# Altium schematic sheet FPGA_Power&GND.SchDoc: FPGA Power&GND
size A4
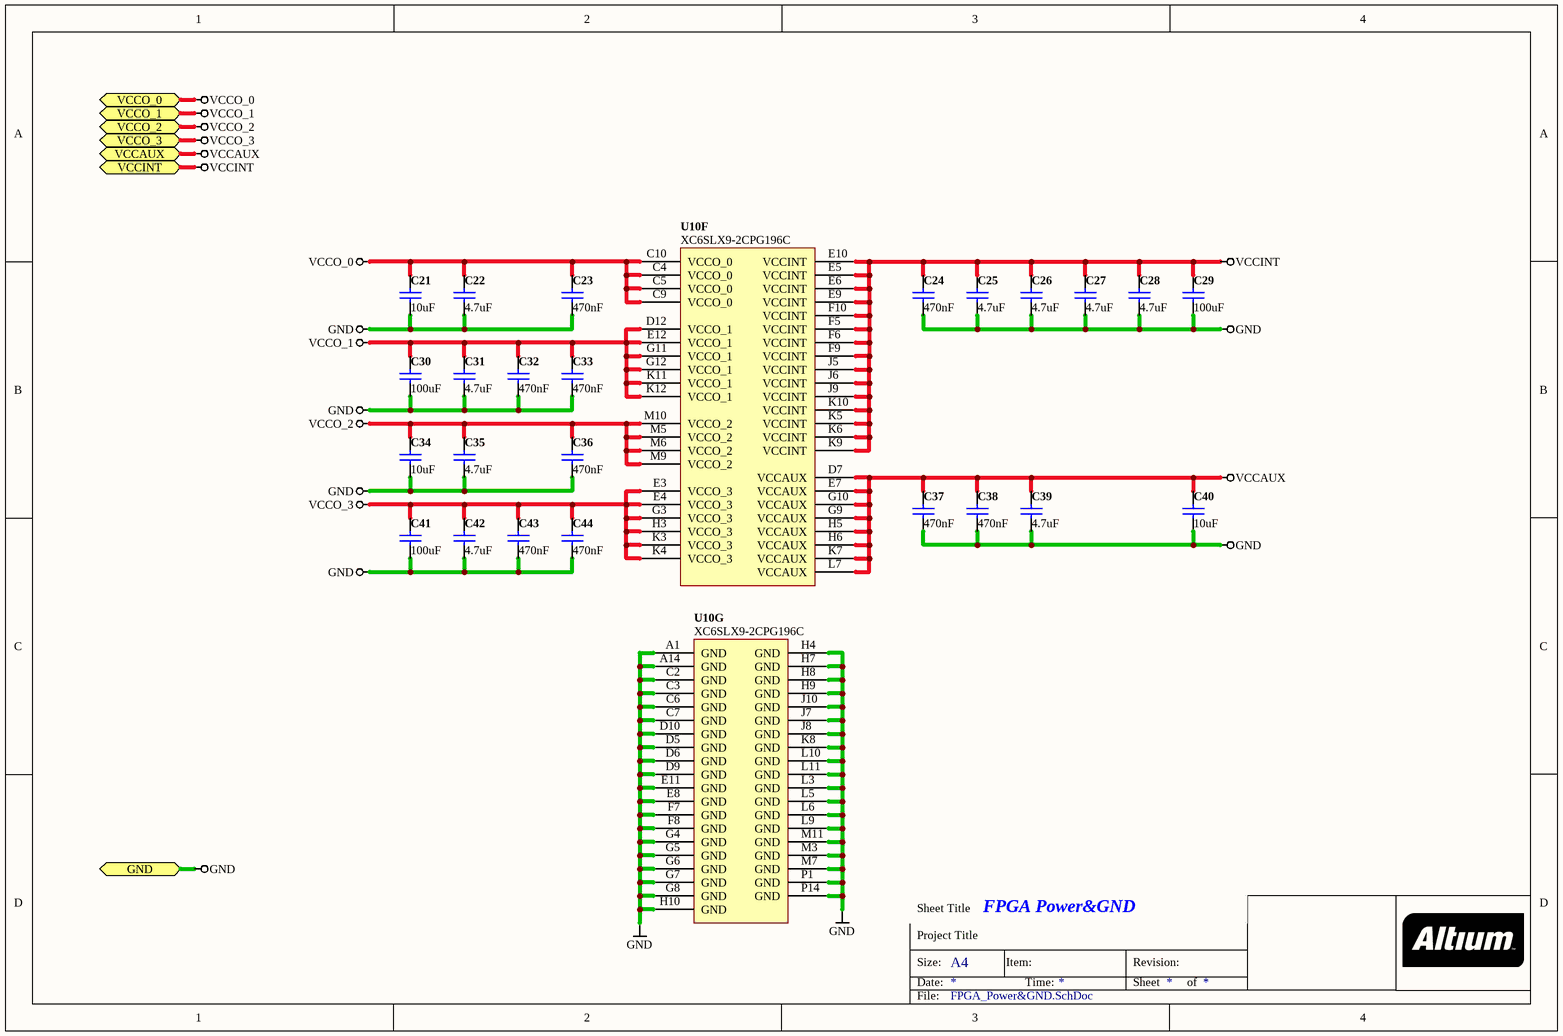
[diagram p0: FPGA_Power&GND.SchDoc]

## Parts
C21  value 10uF  [CAPC0603(1608)100_N]  (hidden comment: CAP 10uF 6.3V 0603(1608))
C22  value 4.7uF  [CAPC0402(1005)60_N]  (hidden comment: CAP 4.7uF 6.3V 0402(1005))
C23  value 470nF  [CAPC0402(1005)60_N]  (hidden comment: CAP 470nF 6.3V 0402(1005))
C24  value 470nF  [CAPC0402(1005)60_N]  (hidden comment: CAP 470nF 6.3V 0402(1005))
C25  value 4.7uF  [CAPC0402(1005)60_N]  (hidden comment: CAP 4.7uF 6.3V 0402(1005))
C26  value 4.7uF  [CAPC0402(1005)60_N]  (hidden comment: CAP 4.7uF 6.3V 0402(1005))
C27  value 4.7uF  [CAPC0402(1005)60_N]  (hidden comment: CAP 4.7uF 6.3V 0402(1005))
C28  value 4.7uF  [CAPC0402(1005)60_N]  (hidden comment: CAP 4.7uF 6.3V 0402(1005))
C29  value 100uF  [CAPC1206(3216)190_L]  (hidden comment: CAP 100uF 6.3V 1206(3216))
C30  value 100uF  [CAPC1206(3216)190_L]  (hidden comment: CAP 100uF 6.3V 1206(3216))
C31  value 4.7uF  [CAPC0402(1005)60_N]  (hidden comment: CAP 4.7uF 6.3V 0402(1005))
C32  value 470nF  [CAPC0402(1005)60_N]  (hidden comment: CAP 470nF 6.3V 0402(1005))
C33  value 470nF  [CAPC0402(1005)60_N]  (hidden comment: CAP 470nF 6.3V 0402(1005))
C34  value 10uF  [CAPC0603(1608)100_N]  (hidden comment: CAP 10uF 6.3V 0603(1608))
C35  value 4.7uF  [CAPC0402(1005)60_N]  (hidden comment: CAP 4.7uF 6.3V 0402(1005))
C36  value 470nF  [CAPC0402(1005)60_N]  (hidden comment: CAP 470nF 6.3V 0402(1005))
C37  value 470nF  [CAPC0402(1005)60_N]  (hidden comment: CAP 470nF 6.3V 0402(1005))
C38  value 470nF  [CAPC0402(1005)60_N]  (hidden comment: CAP 470nF 6.3V 0402(1005))
C39  value 4.7uF  [CAPC0402(1005)60_N]  (hidden comment: CAP 4.7uF 6.3V 0402(1005))
C40  value 10uF  [CAPC0603(1608)100_N]  (hidden comment: CAP 10uF 6.3V 0603(1608))
C41  value 100uF  [CAPC1206(3216)190_L]  (hidden comment: CAP 100uF 6.3V 1206(3216))
C42  value 4.7uF  [CAPC0402(1005)60_N]  (hidden comment: CAP 4.7uF 6.3V 0402(1005))
C43  value 470nF  [CAPC0402(1005)60_N]  (hidden comment: CAP 470nF 6.3V 0402(1005))
C44  value 470nF  [CAPC0402(1005)60_N]  (hidden comment: CAP 470nF 6.3V 0402(1005))
U10  XC6SLX9-2CPG196C  [CPG196]  (parts F,G of 7)

## Ports
GND, VCCAUX, VCCINT, VCCO_0, VCCO_1, VCCO_2, VCCO_3

## Nets
GND: C21.1 C22.2 C23.1 C24.1 C25.1 C26.1 C27.1 C28.2 C29.1 C30.1 C31.1 C32.1 C33.1 C34.1 C35.2 C36.1 C37.1 C38.1 C39.2 C40.1 C41.2 C42.1 C43.1 C44.1 U10.A1(GND) U10.A14(GND) U10.C2(GND) U10.C3(GND) U10.C6(GND) U10.C7(GND) U10.D5(GND) U10.D6(GND) U10.D9(GND) U10.D10(GND) U10.E8(GND) U10.E11(GND) U10.F7(GND) U10.F8(GND) U10.G4(GND) U10.G5(GND) U10.G6(GND) U10.G7(GND) U10.G8(GND) U10.H4(GND) U10.H7(GND) U10.H8(GND) U10.H9(GND) U10.H10(GND) U10.J7(GND) U10.J8(GND) U10.J10(GND) U10.K8(GND) U10.L3(GND) U10.L5(GND) U10.L6(GND) U10.L9(GND) U10.L10(GND) U10.L11(GND) U10.M3(GND) U10.M7(GND) U10.M11(GND) U10.P1(GND) U10.P14(GND) ; port GND
VCCAUX: C37.2 C38.2 C39.1 C40.2 U10.D7(VCCAUX) U10.E7(VCCAUX) U10.G9(VCCAUX) U10.G10(VCCAUX) U10.H5(VCCAUX) U10.H6(VCCAUX) U10.K7(VCCAUX) U10.L7(VCCAUX) ; port VCCAUX
VCCINT: C24.2 C25.2 C26.2 C27.2 C28.1 C29.2 U10.E5(VCCINT) U10.E6(VCCINT) U10.E9(VCCINT) U10.E10(VCCINT) U10.F5(VCCINT) U10.F6(VCCINT) U10.F9(VCCINT) U10.F10(VCCINT) U10.J5(VCCINT) U10.J6(VCCINT) U10.J9(VCCINT) U10.K5(VCCINT) U10.K6(VCCINT) U10.K9(VCCINT) U10.K10(VCCINT) ; port VCCINT
VCCO_0: C21.2 C22.1 C23.2 U10.C4(VCCO_0) U10.C5(VCCO_0) U10.C9(VCCO_0) U10.C10(VCCO_0) ; port VCCO_0
VCCO_1: C30.2 C31.2 C32.2 C33.2 U10.D12(VCCO_1) U10.E12(VCCO_1) U10.G11(VCCO_1) U10.G12(VCCO_1) U10.K11(VCCO_1) U10.K12(VCCO_1) ; port VCCO_1
VCCO_2: C34.2 C35.1 C36.2 U10.M5(VCCO_2) U10.M6(VCCO_2) U10.M9(VCCO_2) U10.M10(VCCO_2) ; port VCCO_2
VCCO_3: C41.1 C42.2 C43.2 C44.2 U10.E3(VCCO_3) U10.E4(VCCO_3) U10.G3(VCCO_3) U10.H3(VCCO_3) U10.K3(VCCO_3) U10.K4(VCCO_3) ; port VCCO_3

## Notes on the sheet
- Sheet Title
- Project Title
- Size:
- Date:
- A4
- Item:
- Time:
- Revision:
- Sheet
- of
- File:

## Library data of the parts
C21 C34 C40 = CMP-1035-02797-1: CAP 10uF 6.3V ?0% 0603 (1608 Metric) Thickness 1mm SMD; Case-EIA: 0603; Case-Metric: 1608; Technology: SMT; Rated Voltage: 6.3 V; Max Thickness: 1 mm; Tolerance: ?0%
C22 C28 C35 C39 = CMP-1034-02137-1: CAP 4.7uF 6.3V ?0% 0402 (1005 Metric) Thickness 0.6mm SMD; Case-Metric: 1005; Case-EIA: 0402; Rated Voltage: 6.3 V; Technology: SMT; Max Thickness: 0.6 mm; Tolerance: ?0%
C23 C24 C32 C33 C36-C38 C43 C44 = CMP-1034-02104-1: CAP 470nF 6.3V ?0% 0402 (1005 Metric) Thickness 0.6mm SMD; Case-EIA: 0402; Case-Metric: 1005; Tolerance: ?0%; Rated Voltage: 6.3 V; Max Thickness: 0.6 mm; Technology: SMT
C25-C27 C31 C42 = CMP-1034-02137-1: CAP 4.7uF 6.3V ?0% 0402 (1005 Metric) Thickness 0.6mm SMD; Case-EIA: 0402; Case-Metric: 1005; Technology: SMT; Rated Voltage: 6.3 V; Max Thickness: 0.6 mm; Tolerance: ?0%
C29 C30 = CMP-1037-05005-1: CAP 100uF 6.3V ?0% 1206 (3216 Metric) Thickness 1.9mm SMD; Case-EIA: 1206; Case-Metric: 3216; Technology: SMT; Rated Voltage: 6.3 V; Max Thickness: 1.9 mm; Tolerance: ?0%
C41 = CMP-1037-05005-1: CAP 100uF 6.3V ?0% 1206 (3216 Metric) Thickness 1.9mm SMD; Case-Metric: 3216; Case-EIA: 1206; Rated Voltage: 6.3 V; Technology: SMT; Max Thickness: 1.9 mm; Tolerance: ?0%
U10 = CMP-0067-00328-1: Spartan-6 LX 1.2V FPGA, 106 User I/Os, 196-Ball Chip-Scale BGA (0.5mm Pitch), Speed Grade 2, Commercial Grade, Pb-Free; Code_JEDEC: MO-275; PackageReference: CPG196; PackageDescription: 196-Ball Chip Scale Ball Grid Array 0.5 mm Pitch (CPG196) - Pb-Free; DatasheetVersion: ver1.6, Nov-2010; PackageVersion: ver1.0, Dec-2009